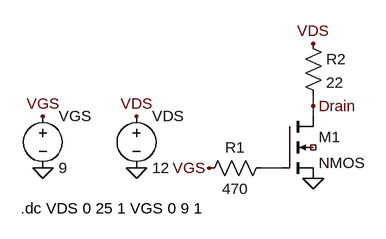
[diagram p0: schematic mosfet simulation.asc]
mosfet simulation.asc, the LTspice schematic file:
Version 4
SHEET 1 880 680
WIRE 32 -192 32 -208
WIRE 32 -176 32 -192
WIRE -16 -96 -48 -96
FLAG 32 -192 Drain
FLAG -128 -96 VGS
FLAG -384 -176 VGS
FLAG -240 -176 VDS
FLAG 32 -288 VDS
FLAG 32 -80 0
FLAG -240 -96 0
FLAG -384 -96 0
SYMBOL nmos4 -16 -176 R0
SYMATTR InstName M1
SYMBOL voltage -384 -192 R0
SYMATTR InstName VGS
SYMATTR Value 9
SYMBOL voltage -240 -192 R0
SYMATTR InstName VDS
SYMATTR Value 12
SYMBOL res -144 -80 R270
WINDOW 0 32 56 VTop 2
WINDOW 3 0 56 VBottom 2
SYMATTR InstName R1
SYMATTR Value 470
SYMBOL res 16 -304 R0
SYMATTR InstName R2
SYMATTR Value 22
TEXT -418 -34 Left 2 !.dc VDS 0 25 1 VGS 0 9 1

The netlist it stands for:
* mosfet simulation.asc
M1 Drain N001 0 NC_01 NMOS
VGS VGS 0 9
VDS VDS 0 12
R1 VGS N001 470
R2 VDS Drain 22
.model NMOS NMOS
.model PMOS PMOS
.lib standard.mos
.dc VDS 0 25 1 VGS 0 9 1
.backanno
.end